# Altium schematic sheet Mazzoleni.SchDoc
size Letter; CompanyName: Ploopy Corporation; Organization: Ploopy Corporation; Address1: 137-1140 Burnhamthorpe Road W; Address2: Mississauga; Address3: Ontario; Address4: Canada L5C 0A3; DocumentNumber: 1; Revision: R1.008; SheetNumber: 1; SheetTotal: 1
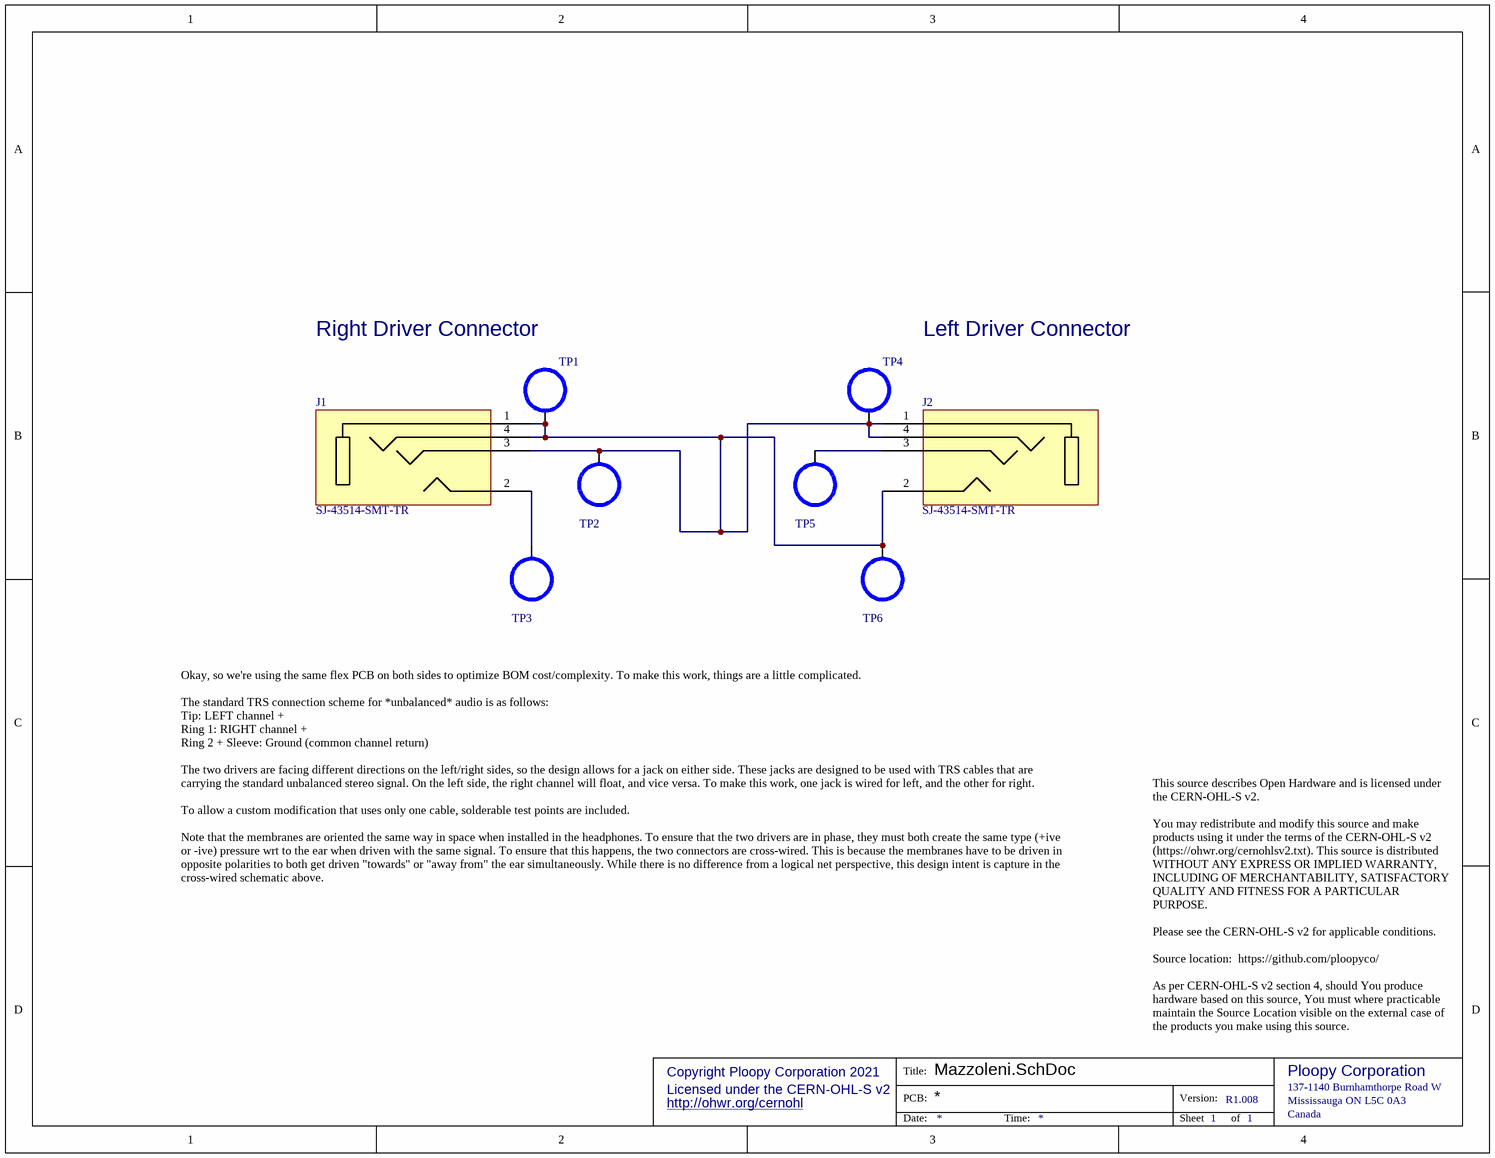
[diagram p0: Mazzoleni.SchDoc]

## Parts
J1  SJ-43514-SMT-TR  [SJ-43514-SMT-TR]
J2  SJ-43514-SMT-TR  [SJ-43514-SMT-TR]
TP1  FlexSolderPad  [FlexSolderPad]  (value not drawn)  (no BOM)
TP2  FlexSolderPad  [FlexSolderPad]  (value not drawn)  (no BOM)
TP3  FlexSolderPad  [FlexSolderPad]  (value not drawn)  (no BOM)
TP4  FlexSolderPad  [FlexSolderPad]  (value not drawn)  (no BOM)
TP5  FlexSolderPad  [FlexSolderPad]  (value not drawn)  (no BOM)
TP6  FlexSolderPad  [FlexSolderPad]  (value not drawn)  (no BOM)

## Nets
NetJ1_1: J1.1 J1.3 J1.4 J2.1 J2.2 J2.4 TP1.1 TP2.1 TP4.1 TP6.1
NetJ1_2: J1.2 TP3.1
NetJ2_3: J2.3 TP5.1

## Notes on the sheet
- Right Driver Connector
- Left Driver Connector
- Okay, so we're using the same flex PCB on both sides to optimize BOM cost/complexity. To make this work, things are a little complicated.
  The standard TRS connection scheme for *unbalanced* audio is as follows:
  Tip: LEFT channel +
  Ring 1: RIGHT channel +
  Ring 2 + Sleeve: Ground (common channel return)
  The two drivers are facing different directions on the left/right sides, so the design allows for a jack on either side. These jacks are designed to be used with TRS cables that are carrying the standard unbalanced stereo signal. On the left side, the right channel will float, and vice versa. To make this work, one jack is wired for left, and the other for right.
  To allow a custom modification that uses only one cable, solderable test points are included.
  Note that the membranes are oriented the same way in space when installed in the headphones. To ensure that the two drivers are in phase, they must both create the same type (+ive or -ive) pressure wrt to the ear when driven with the same signal. To ensure that this happens, the two connectors are cross-wired. This is because the membranes have to be driven in opposite polarities to both get driven "towards" or "away from" the ear simultaneously. While there is no difference from a logical net perspective, this design intent is capture in the cross-wired schematic above.
- This source describes Open Hardware and is licensed under the CERN-OHL-S v2.
  You may redistribute and modify this source and make products using it under the terms of the CERN-OHL-S v2 (https://ohwr.org/cernohlsv2.txt). This source is distributed WITHOUT ANY EXPRESS OR IMPLIED WARRANTY, INCLUDING OF MERCHANTABILITY, SATISFACTORY QUALITY AND FITNESS FOR A PARTICULAR PURPOSE.
  Please see the CERN-OHL-S v2 for applicable conditions.
  Source location:  https://github.com/ploopyco/
  As per CERN-OHL-S v2 section 4, should You produce hardware based on this source, You must where practicable maintain the Source Location visible on the external case of the products you make using this source.
- Copyright Ploopy Corporation 2021
- Licensed under the CERN-OHL-S v2
- http://ohwr.org/cernohl
- Title:
- PCB:
- Version:
- Ploopy Corporation
- Mississauga ON L5C 0A3
- 137-1140 Burnhamthorpe Road W
- Date:
- Time:
- Sheet
- of
- Canada

## Library data of the parts
J1 J2 = SJ-43514-SMT-TR: 3.50mm (0.141", 1/8", Mini Plug) - Headphone Phone Jack Stereo (4 Conductor, TRRS) Connector Solder; Supplier 1: Digi-Key; Supplier 2: Mouser; Supplier Part Number 2: 490-SJ-43514-SMT-TR; Supplier Part Number 1: CP-43514SJCT-ND
TP1-TP6 = FlexSolderPad: Pad designed for soldering a wire to a flex PCB. Reinforced for durability.